# EAGLE design FISCuntrol Board2-CAN (EAGLE 9.6.2)
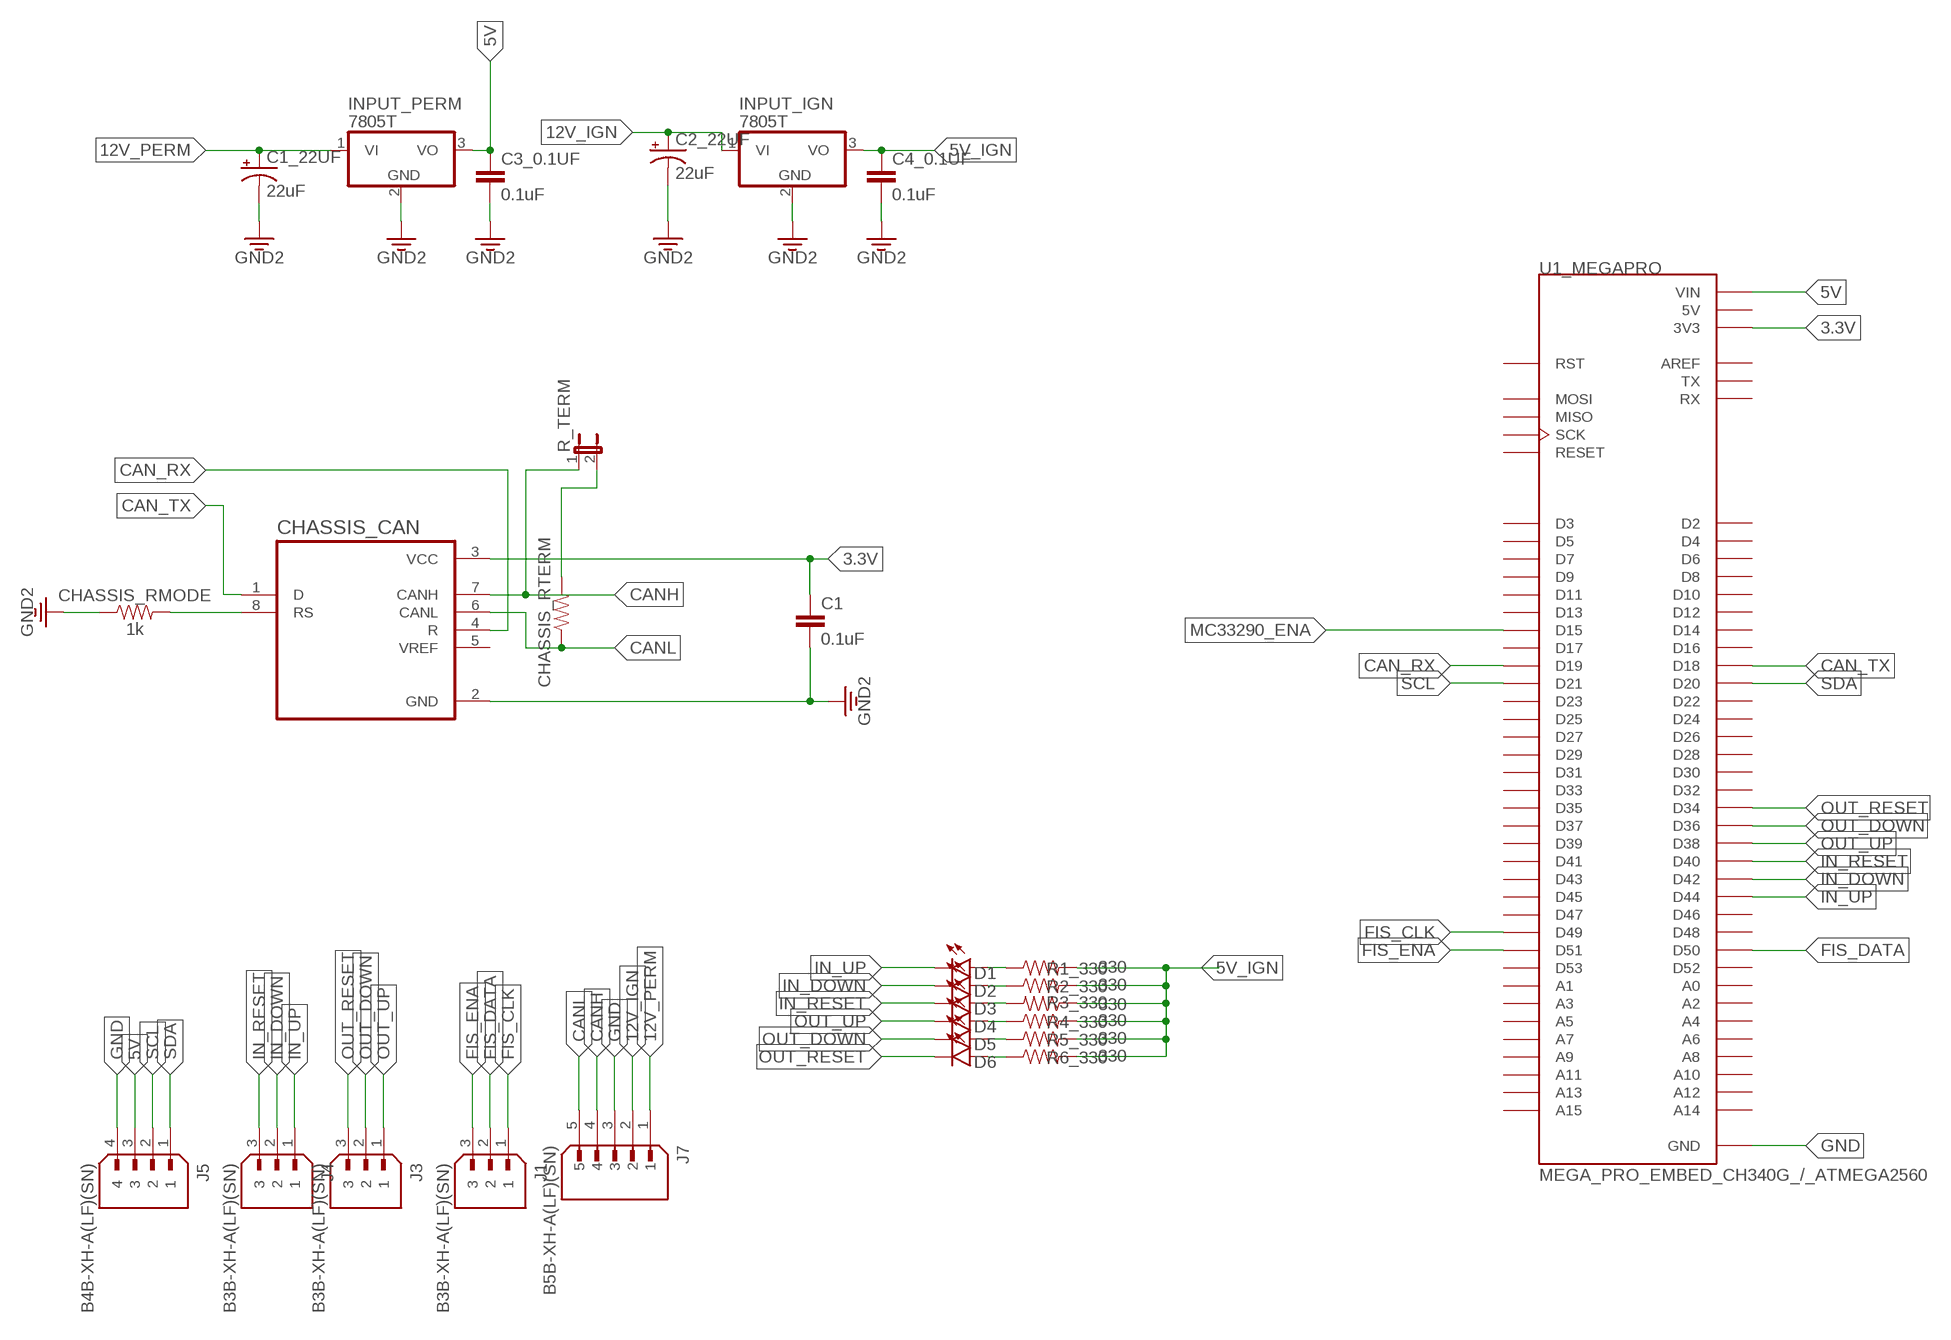
[diagram p0: schematic, sheet 1]

## Parts
C1  0.1uF  0.1UF-0402-16V-10%  [0402]
C1_22UF  22uF  22UF-POLAR-PANASONIC_C-35V-20%  [PANASONIC_C]
C2_22UF  22uF  22UF-POLAR-PANASONIC_C-35V-20%  [PANASONIC_C]
C3_0.1UF  0.1uF  0.1UF-0603-25V-5%  [0603]
C4_0.1UF  0.1uF  0.1UF-0603-25V-5%  [0603]
CHASSIS_CAN  SN65HVD230DR  [SOIC127P599X175-8N]
CHASSIS_RMODE  1k  1KOHM-0603-1/10W-1%  [0603]
CHASSIS_RTERM  RESISTORAXIAL-0.3  [AXIAL-0.3]
D1  LED3MM  [LED_3MM]
D2  LED3MM  [LED_3MM]
D3  LED3MM  [LED_3MM]
D4  LED3MM  [LED_3MM]
D5  LED3MM  [LED_3MM]
D6  LED3MM  [LED_3MM]
INPUT_IGN  7805T  [TO220H]
INPUT_PERM  7805T  [TO220H]
J1  B3B-XH-A(LF)(SN)  [JST_B3B-XH-A(LF)(SN)]
J3  B3B-XH-A(LF)(SN)  [JST_B3B-XH-A(LF)(SN)]
J4  B3B-XH-A(LF)(SN)  [JST_B3B-XH-A(LF)(SN)]
J5  B4B-XH-A(LF)(SN)  [JST_B4B-XH-A(LF)(SN)]
J7  B5B-XH-A(LF)(SN)  [JST_B5B-XH-A(LF)(SN)]
R1_330  330  330OHM-HORIZ-1/10W-5%  [AXIAL-0.3]
R2_330  330  330OHM-HORIZ-1/10W-5%  [AXIAL-0.3]
R3_330  330  330OHM-HORIZ-1/10W-5%  [AXIAL-0.3]
R4_330  330  330OHM-HORIZ-1/10W-5%  [AXIAL-0.3]
R5_330  330  330OHM-HORIZ-1/10W-5%  [AXIAL-0.3]
R6_330  330  330OHM-HORIZ-1/10W-5%  [AXIAL-0.3]
R_TERM  JP1E  [JP1]
U1_MEGAPRO  MEGA_PRO_EMBED_CH340G_/_ATMEGA2560  [MODULE_MEGA_PRO_EMBED_CH340G_/_ATMEGA2560]

## Nets
3.3V: C1.1 CHASSIS_CAN.3(VCC) U1_MEGAPRO.3V3_1(3V3) U1_MEGAPRO.3V3_2(3V3)
5V: C3_0.1UF.1 INPUT_PERM.3(VO) J5.3 U1_MEGAPRO.VIN_1(VIN) U1_MEGAPRO.VIN_2(VIN)
5V_IGN: C4_0.1UF.1 INPUT_IGN.3(VO) R1_330.P$2 R2_330.P$2 R3_330.P$1 R4_330.P$2 R5_330.P$2 R6_330.P$2
12V_IGN: C2_22UF.+ INPUT_IGN.1(VI) J7.2
12V_PERM: C1_22UF.+ INPUT_PERM.1(VI) J7.1
CAN_RX: CHASSIS_CAN.4(R) U1_MEGAPRO.D19
CAN_TX: CHASSIS_CAN.1(D) U1_MEGAPRO.D18
CANH: CHASSIS_CAN.7(CANH) J7.4 R_TERM.1
CANL: CHASSIS_CAN.6(CANL) CHASSIS_RTERM.P$1 J7.5
FIS_CLK: J1.1 U1_MEGAPRO.D49
FIS_DATA: J1.2 U1_MEGAPRO.D50
FIS_ENA: J1.3 U1_MEGAPRO.D51
GND: C1.2 C1_22UF.- C2_22UF.- C3_0.1UF.2 C4_0.1UF.2 CHASSIS_CAN.2(GND) CHASSIS_RMODE.1 INPUT_IGN.2(GND) INPUT_PERM.2(GND) J5.4 J7.3 U1_MEGAPRO.GND_1(GND) U1_MEGAPRO.GND_2(GND) U1_MEGAPRO.GND_3(GND) ; supply symbol labelled GND2
IN_DOWN: D2.K(C) J4.2 U1_MEGAPRO.D42
IN_RESET: D3.K(C) J4.3 U1_MEGAPRO.D40
IN_UP: D1.K(C) J4.1 U1_MEGAPRO.D44
MC33290_ENA: U1_MEGAPRO.D15
N$1: D1.A R1_330.P$1
N$2: D5.A R5_330.P$1
N$3: D2.A R2_330.P$1
N$4: D3.A R3_330.P$2
N$5: D6.A R6_330.P$1
N$6: D4.A R4_330.P$1
N$7 [New Class]: CHASSIS_CAN.8(RS) CHASSIS_RMODE.2
N$8: CHASSIS_RTERM.P$2 R_TERM.2
OUT_DOWN: D5.K(C) J3.2 U1_MEGAPRO.D36
OUT_RESET: D6.K(C) J3.3 U1_MEGAPRO.D34
OUT_UP: D4.K(C) J3.1 U1_MEGAPRO.D38
SCL: J5.2 U1_MEGAPRO.D21
SDA: J5.1 U1_MEGAPRO.D20
Unconnected: CHASSIS_CAN.5(VREF) U1_MEGAPRO.A0 U1_MEGAPRO.A1 U1_MEGAPRO.A2 U1_MEGAPRO.A3 U1_MEGAPRO.A4 U1_MEGAPRO.A5 U1_MEGAPRO.A6 U1_MEGAPRO.A7 U1_MEGAPRO.A8 U1_MEGAPRO.A9 U1_MEGAPRO.A10 U1_MEGAPRO.A11 U1_MEGAPRO.A12 U1_MEGAPRO.A13 U1_MEGAPRO.A14 U1_MEGAPRO.A15 U1_MEGAPRO.AREF U1_MEGAPRO.D2 U1_MEGAPRO.D3 U1_MEGAPRO.D4 U1_MEGAPRO.D5 U1_MEGAPRO.D6 U1_MEGAPRO.D7 U1_MEGAPRO.D8 U1_MEGAPRO.D9 U1_MEGAPRO.D10 U1_MEGAPRO.D11 U1_MEGAPRO.D12 U1_MEGAPRO.D13 U1_MEGAPRO.D14 U1_MEGAPRO.D16 U1_MEGAPRO.D17 U1_MEGAPRO.D22 U1_MEGAPRO.D23 U1_MEGAPRO.D24 U1_MEGAPRO.D25 U1_MEGAPRO.D26 U1_MEGAPRO.D27 U1_MEGAPRO.D28 U1_MEGAPRO.D29 U1_MEGAPRO.D30 U1_MEGAPRO.D31 U1_MEGAPRO.D32 U1_MEGAPRO.D33 U1_MEGAPRO.D35 U1_MEGAPRO.D37 U1_MEGAPRO.D39 U1_MEGAPRO.D41 U1_MEGAPRO.D43 U1_MEGAPRO.D45 U1_MEGAPRO.D46 U1_MEGAPRO.D47 U1_MEGAPRO.D48 U1_MEGAPRO.D52 U1_MEGAPRO.D53 U1_MEGAPRO.MISO U1_MEGAPRO.MOSI U1_MEGAPRO.RESET U1_MEGAPRO.RST U1_MEGAPRO.RX U1_MEGAPRO.SCK U1_MEGAPRO.TX

## Power pins joined to a net without a drawn wire
5V: U1_MEGAPRO.5V_1(5V) U1_MEGAPRO.5V_2(5V) U1_MEGAPRO.5V_3(5V)

## Library data of the parts
C1 = SparkFun-Capacitors:0.1UF: 0.1µF ceramic capacitors A capacitor is a passive two-terminal electrical component used to store electrical energy temporarily in an electric field.; PROD_ID: CAP-12416
C1_22UF C2_22UF = SparkFun-Capacitors:22UF-POLAR: 22µF polarized capacitors A capacitor is a passive two-terminal electrical component used to store electrical energy temporarily in an electric field.; PROD_ID: CAP-08618
C3_0.1UF C4_0.1UF = SparkFun-Capacitors:0.1UF: 0.1µF ceramic capacitors A capacitor is a passive two-terminal electrical component used to store electrical energy temporarily in an electric field.; PROD_ID: CAP-08604
CHASSIS_CAN = SN65HVD230DR:SN65HVD230DR; DESCRIPTION: 3.3 V CAN Transceiver with Standby Mode; DIGIKEY_PART_NUMBER: 296-11654-2-ND; MF: Texas Instruments; MP: SN65HVD230DR; PACKAGE: SOIC-8 Texas Instruments; PURCHASE-URL: https://pricing.snapeda.com/search?q=SN65HVD230DR&ref=eda
CHASSIS_RMODE = SparkFun-Resistors:1KOHM: 1kΩ resistor A resistor is a passive two-terminal electrical component that implements electrical resistance as a circuit element. Resistors act to reduce current flow, and, at the same time, act to lower voltage levels within circuits. - Wikipedia; PROD_ID: RES-07856
CHASSIS_RTERM = SparkFun-Resistors:RESISTOR: Generic Resistor Package
D1-D6 = SparkFun-LED:LED: LED (Generic) Standard schematic elements and footprints for 5mm, 3mm, 1206, and 0603 sized LEDs. Generic LEDs with no color specified.; PROD_ID: DIO-08794
INPUT_IGN INPUT_PERM = linear:78*: Positive VOLTAGE REGULATOR Source: http://cache.national.com/ds/LM/LM78L05.pdf http://www.fairchildsemi.com/ds/LM/LM7805.pdf
J1 J3 J4 = B3B-XH-A_LF__SN_:B3B-XH-A(LF)(SN): Check availability <https://pricing.snapeda.com/parts/B3B-XH-A%28LF%29%28SN%29/JST%20Sales/view-part?ref=eda>; AVAILABILITY: In Stock; CHECK_PRICES: https://www.snapeda.com/parts/B3B-XH-A(LF)(SN)/JST+Sales+America+Inc./view-part/?ref=eda; DESCRIPTION: Connector Header Through Hole 3 position 0.098 (2.50mm); MF: JST Sales; MP: B3B-XH-A(LF)(SN); PACKAGE: None; PRICE: None; SNAPEDA_LINK: https://www.snapeda.com/parts/B3B-XH-A(LF)(SN)/JST+Sales+America+Inc./view-part/?ref=snap
J5 = B4B-XH-A_LF__SN_:B4B-XH-A(LF)(SN): Check availability <https://pricing.snapeda.com/parts/B4B-XH-A%28LF%29%28SN%29/JST%20Sales/view-part?ref=eda>; AVAILABILITY: In Stock; CHECK_PRICES: https://www.snapeda.com/parts/B4B-XH-A(LF)(SN)/JST+Sales+America+Inc./view-part/?ref=eda; DESCRIPTION: Connector Header Through Hole 4 position 0.098 (2.50mm); MF: JST Sales; MP: B4B-XH-A(LF)(SN); PACKAGE: None; PRICE: None; SNAPEDA_LINK: https://www.snapeda.com/parts/B4B-XH-A(LF)(SN)/JST+Sales+America+Inc./view-part/?ref=snap
J7 = B5B-XH-A_LF__SN_:B5B-XH-A(LF)(SN): Check availability <https://pricing.snapeda.com/parts/B5B-XH-A%28LF%29%28SN%29/JST%20Sales%20America%20Inc./view-part?ref=eda>; AVAILABILITY: In Stock; CHECK_PRICES: https://www.snapeda.com/parts/B5B-XH-A(LF)(SN)/JST+Sales+America+Inc./view-part/?ref=eda; DESCRIPTION: Connector Header Through Hole 5 position 0.098 (2.50mm); MF: JST Sales America Inc.; MP: B5B-XH-A(LF)(SN); PACKAGE: None; PRICE: None; SNAPEDA_LINK: https://www.snapeda.com/parts/B5B-XH-A(LF)(SN)/JST+Sales+America+Inc./view-part/?ref=snap
R1_330 R2_330 R3_330 R4_330 R5_330 R6_330 = SparkFun-Resistors:330OHM: 330Ω resistor A resistor is a passive two-terminal electrical component that implements electrical resistance as a circuit element. Resistors act to reduce current flow, and, at the same time, act to lower voltage levels within circuits. - Wikipedia; PROD_ID: RES-8371
R_TERM = jumper:JP1E: JUMPER
U1_MEGAPRO = MEGA_PRO_EMBED_CH340G___ATMEGA2560:MEGA_PRO_EMBED_CH340G_/_ATMEGA2560: Mega 2560 PRO (Embed) CH340G/ATmega2560-16AU Check availability <https://pricing.snapeda.com/parts/Mega%20Pro%20Embed%20CH340G%20/%20ATmega2560/Robotdyn/view-part?ref=eda>; AVAILABILITY: Not in stock; MF: Robotdyn; MP: Mega Pro Embed CH340G / ATmega2560; PACKAGE: None; PRICE: None

## Module INPUTS
Ports: 12VPERM(io) 12VIGN(io) GROUND(io) KLINE(io)

### Library data of the parts

## Module OUTPUTS
Ports: 5VBUS(io)

### Library data of the parts

## Net classes
0 default: clearance 0.205 mm

## Board
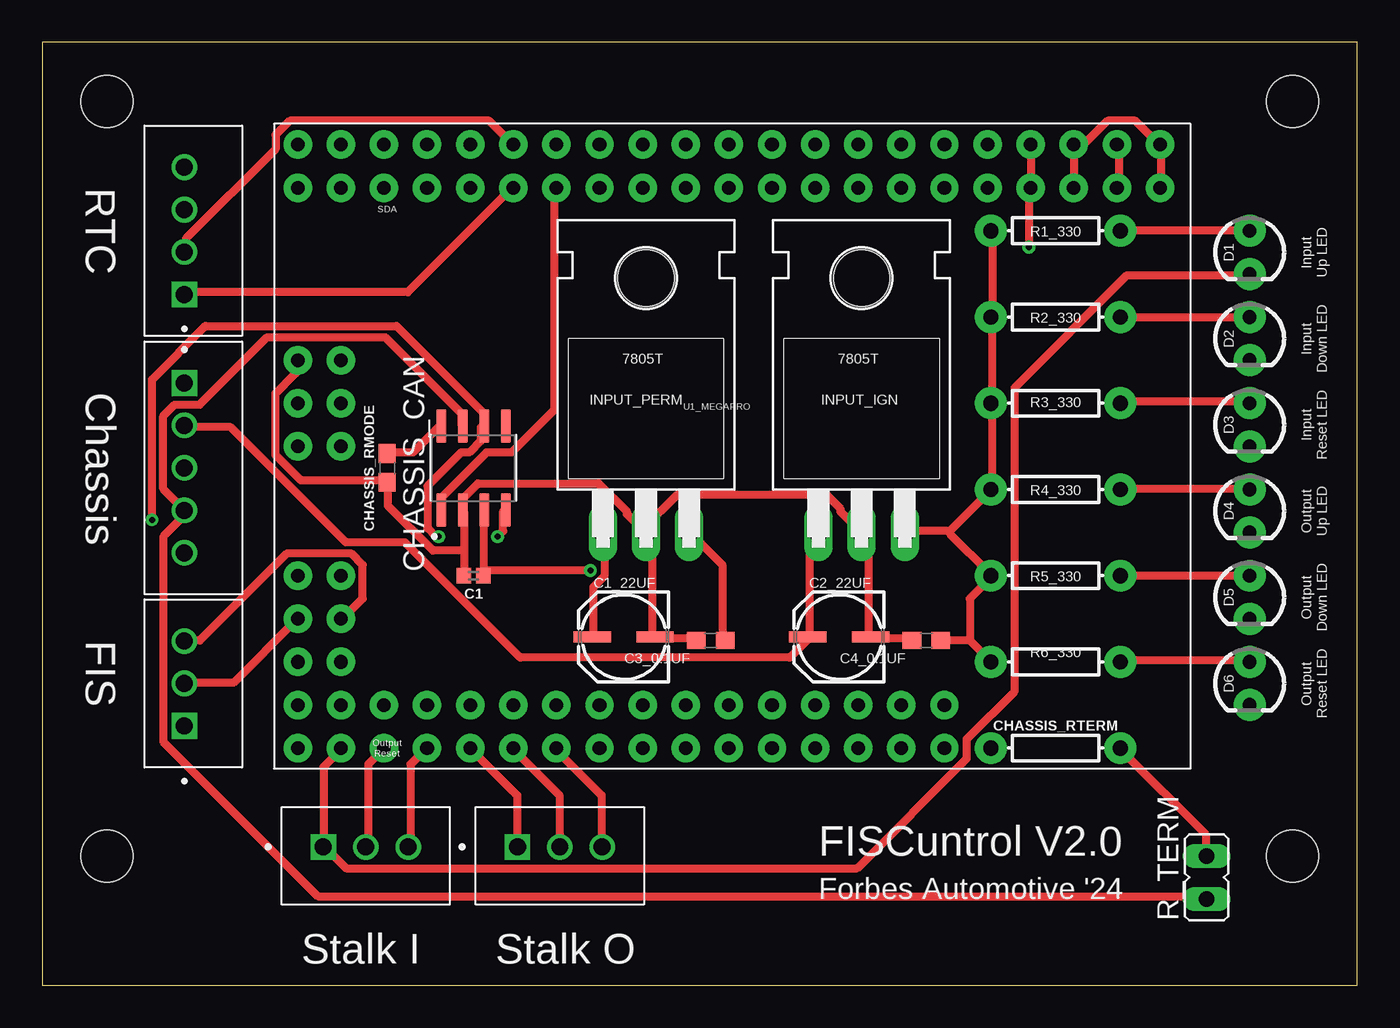
[diagram p1: board, top side]
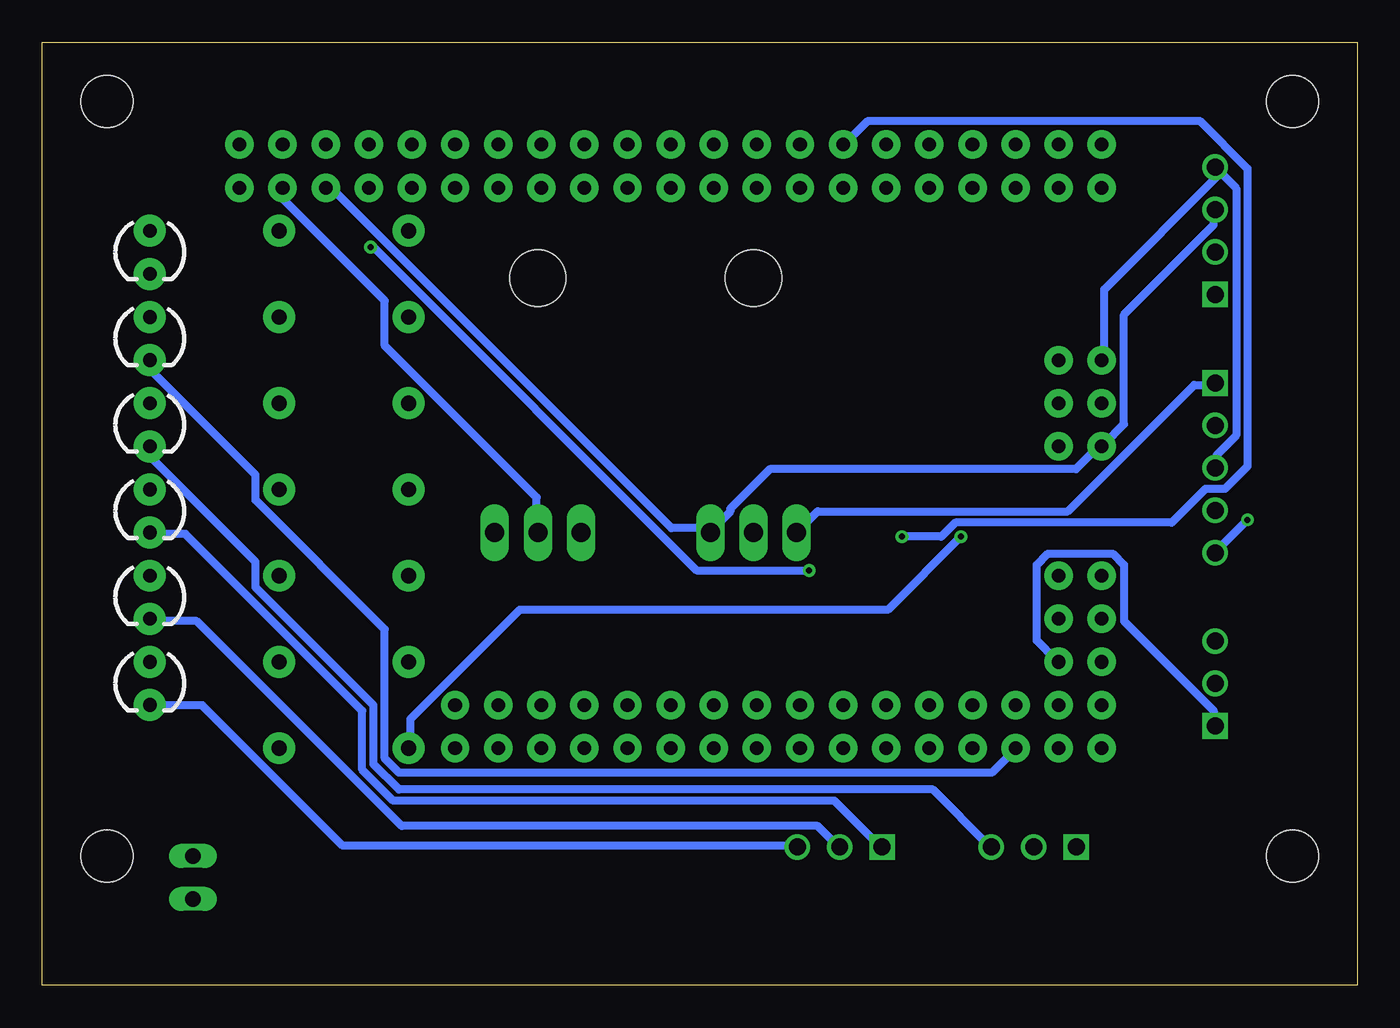
[diagram p2: board, bottom side, seen from below]

Size 77.45 x 55.55 mm. Coordinates in mm from the lower left corner, seen from the top.
Outline: 0,0 77.45,0 77.45,55.55 0,55.55 0,0
Copper layers (1*16): Top 0.035mm / dielectric 1.5mm / Bottom 0.035mm
Design rules "default *": minimum track width 18mil, minimum drill 0.35mm, track to track 6mil, track to pad 6mil, pad to pad 6mil, via to via 6mil, smd to smd 6mil, copper to edge 40mil, drill to drill 6mil, minimum pad ring 10mil, minimum via ring 8mil, stop-mask expansion 4mil, vias tented up to drill 0mil, thermal gap 10mil
Holes 3.05 mm at 73.66,52.07 3.81,7.62 3.81,52.07 73.66,7.62

### Footprints (pad centres in the part's own frame; a part is rotated, then mirrored left to right if it is on the bottom)
0402 = smd 0.85 x 0.9: 1 -0.58,0; 2 0.58,0
PANASONIC_C = smd 2.2 x 0.65: + 1.9,-0.2; - -1.8,-0.2
0603 = smd 1.1 x 1: 1 -0.85,0; 2 0.85,0
SOIC127P599X175-8N = smd 1.97 x 0.6: 1 -2.47,1.905; 2 -2.47,0.635; 3 -2.47,-0.635; 4 -2.47,-1.905; 5 2.47,-1.905; 6 2.47,-0.635; 7 2.47,0.635; 8 2.47,1.905
AXIAL-0.3 = drill 0.9 pad 1.88: P$1 -3.81,0; P$2 3.81,0
LED_3MM = drill 0.813 pad 1.88: A -1.27,0; K 1.27,0
TO220H = drill 1.118 long: 1 -2.54,-10.16; 2 0,-10.16; 3 2.54,-10.16 | hole 3.302: 0,4.826
JST_B3B-XH-A(LF)(SN) = drill 1 square: 1 2.5,-0.525 | drill 1: 2 0,-0.525; 3 -2.5,-0.525
JST_B4B-XH-A(LF)(SN) = drill 1 square: 1 3.75,-0.525 | drill 1: 2 1.25,-0.525; 3 -1.25,-0.525; 4 -3.75,-0.525
JST_B5B-XH-A(LF)(SN) = drill 1 square: 1 -5,-0.525 | drill 1: 2 -2.5,-0.525; 3 0,-0.525; 4 2.5,-0.525; 5 5,-0.525
JP1 = drill 0.914 long: 1 0,-1.27; 2 0,1.27
MODULE_MEGA_PRO_EMBED_CH340G_/_ATMEGA2560 = drill 0.8 pad 1.676: 3V3_1 -17.58,-17.78; 3V3_2 -17.58,-15.24; 5V_1 -20.12,-17.78; 5V_2 -20.12,-15.24; 5V_3 25.6,0; A0 -12.5,17.78; A1 -12.5,15.24; A2 -9.96,17.78; A3 -9.96,15.24; A4 -7.42,17.78; A5 -7.42,15.24; A6 -4.88,17.78; A7 -4.88,15.24; A8 -2.34,17.78; A9 -2.34,15.24; A10 0.2,17.78; A11 0.2,15.24; A12 2.74,17.78; A13 2.74,15.24; A14 5.28,17.78; A15 5.28,15.24; AREF -15.04,-15.24; D2 -9.96,-15.24; D3 -9.96,-17.78; D4 -7.42,-15.24; D5 -7.42,-17.78; D6 -4.88,-15.24; D7 -4.88,-17.78; D8 -2.34,-15.24; D9 -2.34,-17.78; D10 0.2,-15.24; D11 0.2,-17.78; D12 2.74,-15.24; D13 2.74,-17.78; D14 5.28,-15.24; D15 5.28,-17.78; D16 7.82,-15.24; D17 7.82,-17.78; D18 10.36,-15.24; D19 10.36,-17.78; D20 12.9,-15.24; D21 12.9,-17.78; D22 15.44,-15.24; D23 15.44,-17.78; D24 17.98,-15.24; D25 17.98,-17.78; D26 20.52,-15.24; D27 20.52,-17.78; D28 23.06,-15.24; D29 23.06,-17.78; D30 25.6,-15.24; D31 25.6,-17.78; D32 7.82,17.78; D33 7.82,15.24; D34 10.36,17.78; D35 10.36,15.24; D36 12.9,17.78; D37 12.9,15.24; D38 15.44,17.78; D39 15.44,15.24; D40 17.98,17.78; D41 17.98,15.24; D42 20.52,17.78; D43 20.52,15.24; D44 23.06,17.78; D45 23.06,15.24; D46 25.6,17.78; D47 25.6,15.24; D48 25.6,12.7; D49 23.06,12.7; D50 25.6,10.16; D51 23.06,10.16; D52 25.6,7.62; D53 23.06,7.62; GND_1 -22.66,-17.78; GND_2 -22.66,-15.24; GND_3 25.6,-5.08; MISO 23.06,0; MOSI 25.6,-2.54; RESET 23.06,-5.08; RST -15.04,-17.78; RX -12.5,-15.24; SCK 23.06,-2.54; TX -12.5,-17.78; VIN_1 -25.2,-17.78; VIN_2 -25.2,-15.24

### Placement (x,y rotation side)
C1  25.4,24.13 180 top
C1_22UF  34.29,20.32 180 top
C2_22UF  46.99,20.32 180 top
C3_0.1UF  39.37,20.32 180 top
C4_0.1UF  52.07,20.32 180 top
CHASSIS_CAN  25.4,30.48 90 top
CHASSIS_RMODE  20.32,30.48 90 top
CHASSIS_RTERM  59.69,13.97 0 top
D1  71.12,43.18 270 top
D2  71.12,38.1 270 top
D3  71.12,33.02 270 top
D4  71.12,27.94 270 top
D5  71.12,22.86 270 top
D6  71.12,17.78 270 top
INPUT_IGN  48.26,36.83 0 top
INPUT_PERM  35.56,36.83 0 top
J1  8.89,17.78 270 top
J3  30.48,7.62 180 top
J4  19.05,7.62 180 top
J5  8.89,44.45 270 top
J7  8.89,30.48 270 top
R1_330  59.69,44.45 180 top
R2_330  59.69,39.37 180 top
R3_330  59.69,34.29 0 top
R4_330  59.69,29.21 180 top
R5_330  59.69,24.13 180 top
R6_330  59.69,19.05 180 top
R_TERM  68.58,6.35 0 top
U1_MEGAPRO  40.64,31.75 180 top

### Tracks (layer width: path | path; a pad name or v marks a point on that pad's centre or on a via)
3.3V  (via drill 0.35)
  Top 0.457: CHASSIS_CAN.3 25.99,27.92 25.99,24.28 C1.1 26.16,24.44 v32.28,24.44 | v58.11,43.48 58.11,46.96 U1_MEGAPRO.3V3_2 58.27,47.12 58.27,49.44 U1_MEGAPRO.3V3_1
  Bottom 0.457: v32.28,24.44 38.9,24.44 57.94,43.48 v58.11,43.48
5V
  Top 0.457: U1_MEGAPRO.5V_2 60.75,47.12 60.75,49.44 U1_MEGAPRO.5V_1 60.92,49.61 61.42,49.61 62.74,50.93 64.4,50.93 65.72,49.61 U1_MEGAPRO.VIN_1 65.89,49.44 65.89,47.12 U1_MEGAPRO.VIN_2 | C3_0.1UF.1 40.06,20.47 40.06,24.77 38.24,26.59 INPUT_PERM.3
  Bottom 0.457: J5.3 8.44,45.63 8.44,44.8 13.74,39.51 13.74,33.05 14.9,31.89 U1_MEGAPRO.5V_3 15.23,31.73 16.55,30.4 34.6,30.4 36.91,28.08 36.91,27.92 38.07,26.76 INPUT_PERM.3 38.24,26.93 40.39,26.93 60.42,46.96 60.75,46.96 U1_MEGAPRO.5V_2
5V_IGN
  Top 0.457: R1_330.P$2 55.95,44.31 55.95,39.51 R2_330.P$2 55.95,39.18 55.95,34.38 R3_330.P$1 55.95,34.21 55.95,29.41 R4_330.P$2 55.79,29.08 53.47,26.76 | 54.63,20.3 52.97,20.3 C4_0.1UF.1 | 54.63,20.3 55.79,19.15 R6_330.P$2 | 53.47,26.76 50.82,26.76 INPUT_IGN.3 | 53.47,26.76 53.47,26.59 55.79,24.28 R5_330.P$2 55.79,23.95 54.63,22.79 54.63,20.3
12V_IGN
  Top 0.457: INPUT_IGN.1 45.69,26.59 45.19,26.1 45.19,20.63 C2_22UF.+ 45.03,20.3 44.03,19.31 28.14,19.31 21.35,26.1 17.88,26.1 11.09,32.88 8.44,32.88 J7.2
12V_PERM
  Top 0.457: C1_22UF.+ 32.45,20.63 32.45,23.45 33.11,24.11 33.11,26.59 INPUT_PERM.1
  Bottom 0.457: J7.1 8.44,35.37 9.6,35.37 17.05,27.92 31.78,27.92 32.94,26.76 INPUT_PERM.1
CAN_RX  (via drill 0.35)
  Top 0.457: v26.82,26.43 27.15,26.76 27.15,27.92 CHASSIS_CAN.4
  Bottom 0.457: v26.82,26.43 24.5,26.43 23.67,27.26 10.92,27.26 8.94,29.24 7.78,29.24 6.45,30.57 6.45,48.12 9.27,50.93 28.8,50.93 30.13,49.61 U1_MEGAPRO.D19
CAN_TX
  Top 0.457: CHASSIS_CAN.1 23.51,28.08 23.51,28.75 26.16,31.39 27.64,31.39 30.13,33.88 30.13,46.96 U1_MEGAPRO.D18
CANH
  Top 0.457: CHASSIS_CAN.7 24.67,33.05 24.67,33.71 20.2,38.18 13.24,38.18 9.27,34.21 7.78,34.21 7.12,33.55 7.12,29.24 8.28,28.08 J7.4 8.44,27.75 7.12,26.43 7.12,14.34 16.22,5.24 68.53,5.24 R_TERM.1
CANL  (via drill 0.35)
  Top 0.457: v6.45,27.42 6.45,35.7 9.6,38.84 20.86,38.84 25.99,33.71 25.99,33.05 CHASSIS_CAN.6 25.82,32.88 25.82,32.06 25.16,31.39 24.67,31.39 22.68,29.41 22.68,26.93 23.18,26.43 v23.34,26.43
  Bottom 0.457: v6.45,27.42 8.28,25.6 J7.5 | v23.34,26.43 27.64,22.12 49.33,22.12 55.79,15.67 55.79,14.01 CHASSIS_RTERM.P$1
FIS_CLK
  Bottom 0.457: J1.1 8.44,15.34 8.44,16.16 13.74,21.46 13.74,24.77 14.4,25.44 18.21,25.44 18.87,24.77 18.87,20.3 17.71,19.15 U1_MEGAPRO.D49
FIS_DATA
  Top 0.457: J1.2 8.44,17.82 11.25,17.82 14.9,21.46 U1_MEGAPRO.D50
FIS_ENA
  Top 0.457: J1.3 8.44,20.3 9.27,20.3 14.4,25.44 18.21,25.44 18.87,24.77 18.87,22.79 17.71,21.63 U1_MEGAPRO.D51
GND
  Top 0.457: U1_MEGAPRO.GND_2 63.4,47.12 63.4,49.44 U1_MEGAPRO.GND_1 | C4_0.1UF.2 51.15,20.47 48.84,20.47 C2_22UF.- 48.67,20.63 48.67,26.26 48.34,26.59 INPUT_IGN.2 48.17,26.76 47.01,27.92 47.01,28.08 46.19,28.91 37.41,28.91 35.42,26.93 INPUT_PERM.2 | C3_0.1UF.2 38.41,20.47 36.25,20.47 C1_22UF.- 35.92,20.63 35.92,26.26 35.59,26.59 INPUT_PERM.2 | 24.83,25.6 24.83,27.92 CHASSIS_CAN.2 24.83,28.08 24.83,28.75 25.66,29.57 32.78,29.57 34.43,27.92 34.43,27.75 35.42,26.76 INPUT_PERM.2 | 24.83,25.6 24.83,24.28 C1.2 | 24.83,25.6 23.01,25.6 20.36,28.25 20.36,29.57 CHASSIS_RMODE.1 20.2,29.74 15.23,29.74 13.74,31.23 13.74,34.87 14.9,36.03 14.9,36.69 U1_MEGAPRO.GND_3
  Bottom 0.457: U1_MEGAPRO.GND_2 63.24,46.96 63.24,46.3 57.28,40.34 57.28,37.69 48.34,28.75 48.34,26.76 INPUT_IGN.2 | J7.3 8.28,30.57 8.28,31.23 7.12,32.39 7.12,46.96 8.28,48.12 J5.4 8.11,47.78 14.9,41 14.9,36.86 U1_MEGAPRO.GND_3
IN_DOWN
  Top 0.457: J4.2 19.2,8.22 19.2,13.02 20.03,13.85 U1_MEGAPRO.D42
  Bottom 0.457: D2.K 71.02,36.69 71.02,36.2 64.89,30.07 64.89,28.58 57.28,20.97 57.28,13.35 56.45,12.52 21.52,12.52 20.2,13.85 U1_MEGAPRO.D42
IN_RESET
  Top 0.457: J4.3 21.69,8.22 21.69,13.02 22.51,13.85 U1_MEGAPRO.D40
  Bottom 0.457: D3.K 71.02,31.73 71.02,31.06 64.89,24.94 64.89,23.45 57.94,16.5 57.94,13.02 56.45,11.53 25,11.53 21.69,8.22 J4.3
IN_UP
  Top 0.457: U1_MEGAPRO.D44 17.55,13.85 16.55,12.85 16.55,8.22 J4.1 16.72,8.05 17.88,6.89 48.01,6.89 54.46,13.35 54.46,14.51 57.28,17.32 57.28,35.2 63.9,41.82 71.02,41.82 D1.K
N$1
  Top 0.457: R1_330.P$1 63.57,44.47 71.02,44.47 D1.A
N$2
  Top 0.457: R5_330.P$1 63.57,24.11 71.02,24.11 D5.A
N$3
  Top 0.457: R2_330.P$1 63.57,39.34 71.02,39.34 D2.A
N$4
  Top 0.457: R3_330.P$2 63.57,34.38 71.02,34.38 D3.A
N$5
  Top 0.457: R6_330.P$1 63.57,19.15 71.02,19.15 D6.A
N$6
  Top 0.457: R4_330.P$1 63.57,29.24 71.02,29.24 D4.A
N$7
  Top 0.457: CHASSIS_RMODE.2 20.36,31.39 21.85,31.39 23.34,32.88 CHASSIS_CAN.8
N$8
  Top 0.457: R_TERM.2 68.53,7.72 68.53,8.88 63.57,13.85 CHASSIS_RTERM.P$2
OUT_DOWN
  Top 0.457: J3.2 30.46,8.22 30.46,11.2 27.81,13.85 U1_MEGAPRO.D36
  Bottom 0.457: D5.K 71.02,21.46 68.37,21.46 56.28,9.38 31.78,9.38 30.62,8.22 J3.2
OUT_RESET
  Top 0.457: J3.3 32.94,8.22 32.94,11.2 30.29,13.85 U1_MEGAPRO.D34
  Bottom 0.457: D6.K 71.02,16.5 68.04,16.5 59.76,8.22 33.11,8.22 J3.3
OUT_UP
  Top 0.457: J3.1 27.98,8.22 27.98,11.2 25.33,13.85 U1_MEGAPRO.D38
  Bottom 0.457: D4.K 71.02,26.59 69.03,26.59 58.6,16.16 58.6,12.69 56.78,10.87 30.79,10.87 28.14,8.22 J3.1
SCL
  Top 0.457: J5.2 8.44,43.31 8.44,43.98 13.74,49.27 13.74,50.1 14.57,50.93 26.32,50.93 27.64,49.61 U1_MEGAPRO.D21
SDA
  Top 0.457: J5.1 8.44,40.83 21.52,40.83 27.64,46.96 U1_MEGAPRO.D20

### Text on the board
tNames: RTC | SDA | Input / Up LED | Input / Down LED | Chassis | Input / Reset LED | Output / Up LED | Output / Down LED | FIS | Output / Reset LED | Output / Reset | FISCuntrol V2.0 | Forbes Automotive '24 | Stalk I | Stalk O